# EAGLE design cj-mini (EAGLE 7.7.0)
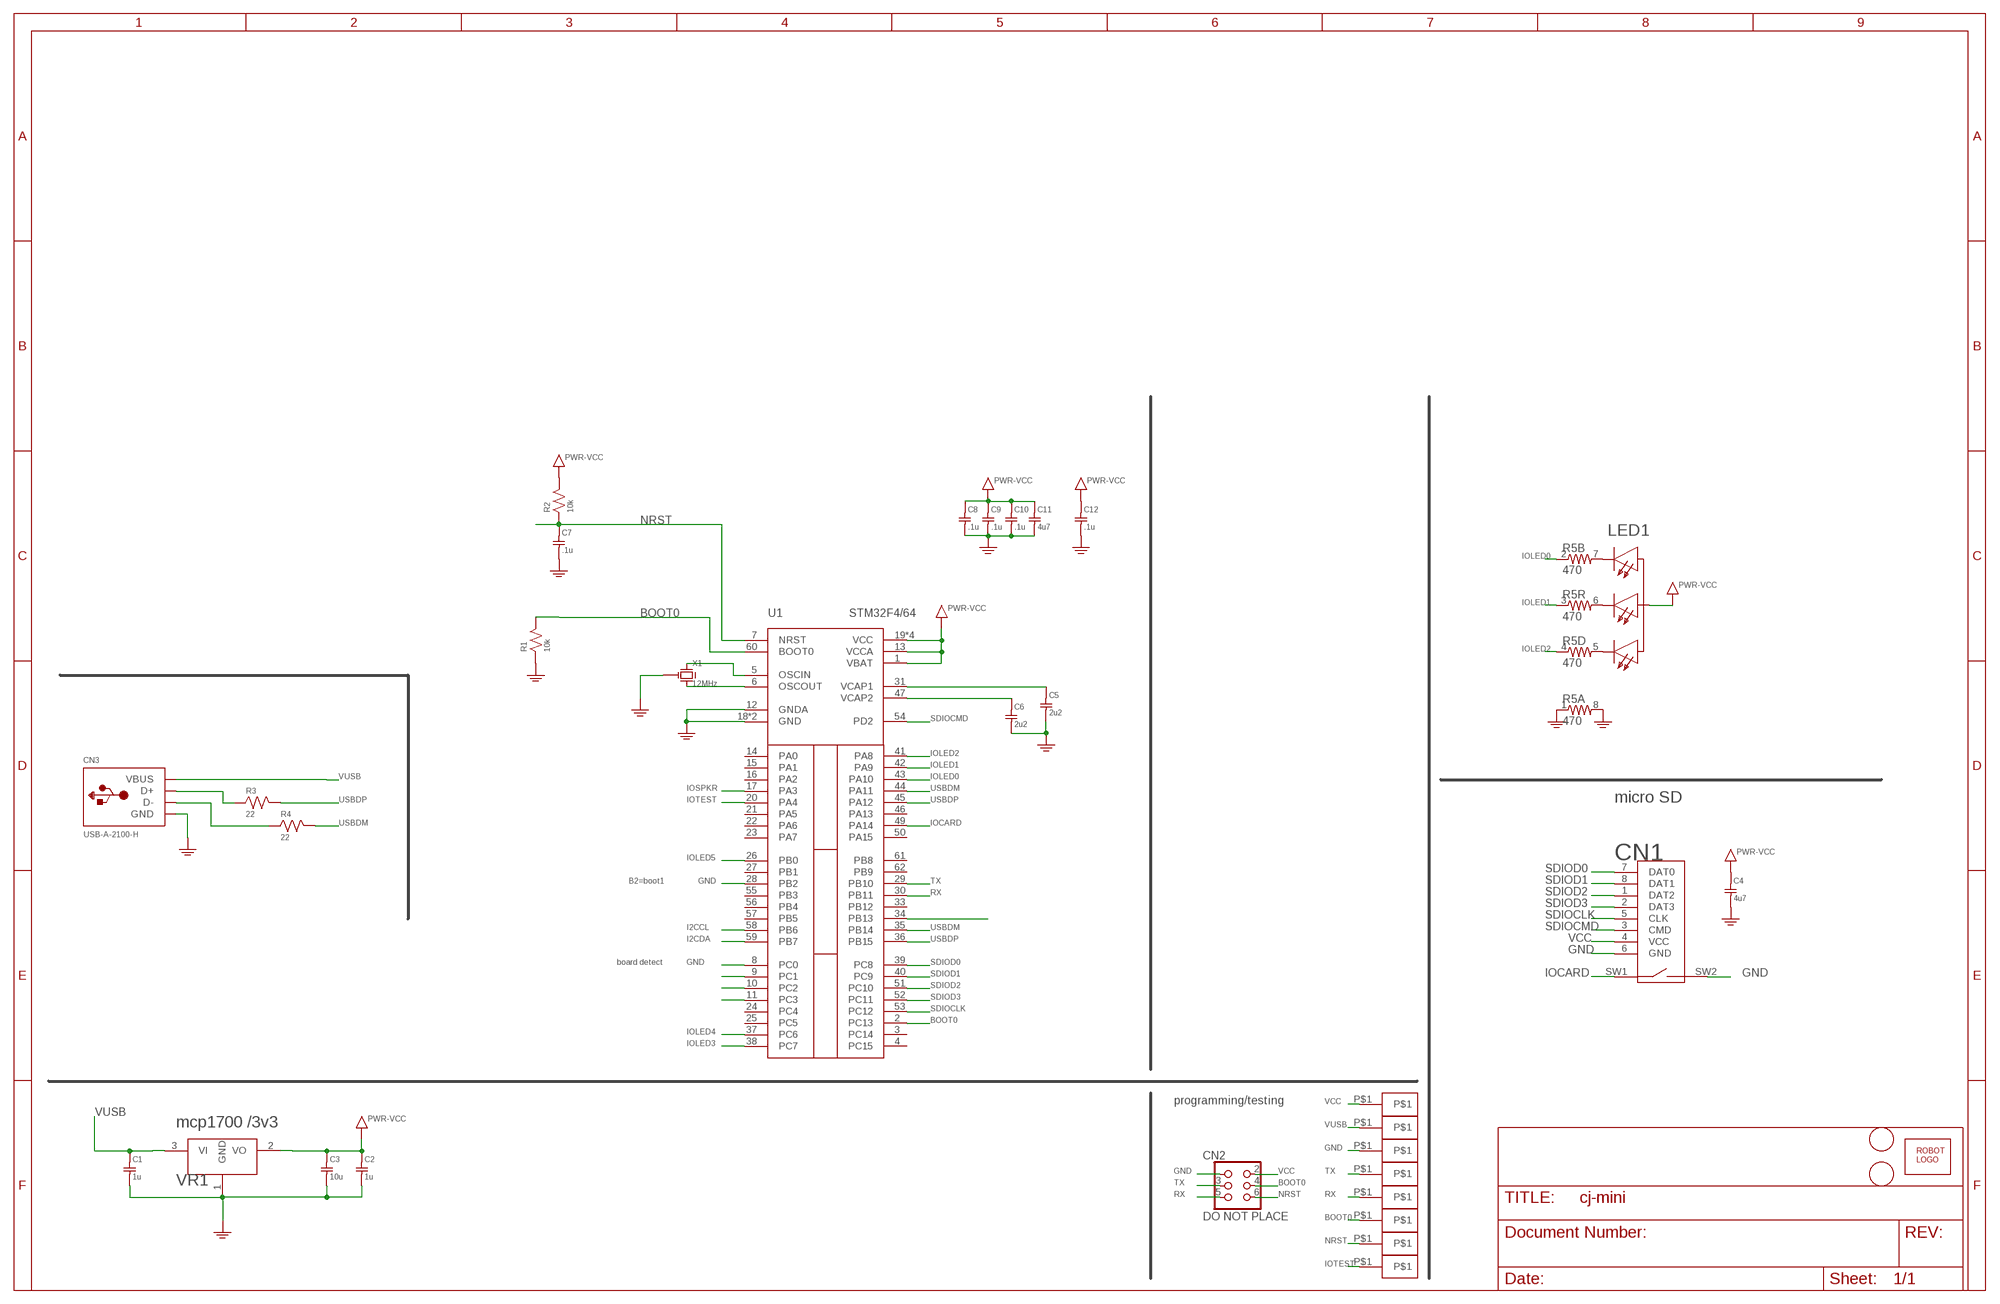
[diagram p0: schematic, sheet 1]

## Parts
C1  1u  C0603  [SMD0603]
C2  1u  C0603  [SMD0603]
C3  10u  C0603  [SMD0603]
C4  4u7  C0603  [SMD0603]
C5  2u2  C0603  [SMD0603]
C6  2u2  C0603  [SMD0603]
C7  .1u  C0603  [SMD0603]
C8  .1u  C0603  [SMD0603]
C9  .1u  C0603  [SMD0603]
C10  .1u  C0603  [SMD0603]
C11  4u7  C0603  [SMD0603]
C12  .1u  C0603  [SMD0603]
CN1  MICROSDPLAIN  [MICROSD/MOLEX/FRONT/PLAIN]
CN2  DO NOT PLACE  HEADER-3X2-PTH1.27  [HEADER-3X2-PTH1.27]
CN3  USB-A-2100-H  [MOLEX_480372100-HOLE]
CN4  HEADER-1X1-SPOT  [SPOT]
CN5  HEADER-1X1-SPOT  [SPOT]
CN6  HEADER-1X1-SPOT  [SPOT]
CN7  HEADER-1X1-SPOT  [SPOT]
CN8  HEADER-1X1-SPOT  [SPOT]
CN9  HEADER-1X1-SPOT  [SPOT]
CN10  HEADER-1X1-SPOT  [SPOT]
CN11  HEADER-1X1-SPOT  [SPOT]
LED1  LED-RGB-CA-PLCC4  [PLCC4-3228]
R1  10k  R0603  [SMD0603]
R2  10k  R0603  [SMD0603]
R3  22  R0603  [SMD0603]
R4  22  R0603  [SMD0603]
R5  470  R-ARRAY40603-ARV  [SMD-0603-ARV]
U1  STM32F4/64  [TQFP64]
U$1  ROBOTMAN-LOGO  [ROBOTMAN-LOGO]
U$2  FIDUCIAL  [FIDUCIAL_1MM]
U$3  FIDUCIAL  [FIDUCIAL_1MM]
VR1  mcp1700 /3v3  REGULATOR-SOT23-3  [SOT-23-3@1]
X1  12MHz  RESONATORCTCE  [RESONATOR-CSTCE]

## Nets
BOOT0: CN2.4 CN8.P$1 R1.2 U1.2(PC13) U1.60(BOOT0)
GND: C1.2 C2.2 C3.2 C4.2 C5.2 C6.2 C7.2 C8.2 C9.2 C10.2 C11.2 C12.2 CN1.6(GND) CN1.SW2 CN2.1 CN3.4(GND) CN3.P$1(GND) CN3.P$2(GND) CN5.P$1 R1.1 R5.1 R5.8 U1.8(PC0) U1.12(GNDA) U1.18(GND) U1.28(PB2) U1.63(GND) VR1.1(GND) X1.2(G) ; supply symbol labelled PWR-GND
I2CCL: U1.58(PB6)
I2CDA: U1.59(PB7)
IOCARD: CN1.SW1 U1.49(PA14)
IOLED0: R5.2 U1.43(PA10)
IOLED1: R5.3 U1.42(PA9)
IOLED2: R5.4 U1.41(PA8)
IOLED3: U1.38(PC7)
IOLED4: U1.37(PC6)
IOLED5: U1.26(PB0)
IOSPKR: U1.17(PA3)
IOTEST: CN11.P$1 U1.20(PA4)
N$1: LED1.P$4(CB) R5.6
N$2: U1.34(PB13)
N$3: LED1.P$2(CR) R5.5
N$4: C6.1 U1.47(VCAP2)
N$5: LED1.P$3(CG) R5.7
N$6: U1.9(PC1)
N$7: CN3.2(D-) R4.1
N$8: CN3.3(D+) R3.1
N$9: U1.10(PC2)
N$10: U1.11(PC3)
N$12: U1.5(OSCIN) X1.1(X1)
N$13: U1.6(OSCOUT) X1.3(X2)
N$18: C5.1 U1.31(VCAP1)
NRST: C7.1 CN2.6 CN9.P$1 R2.1 U1.7(NRST)
RX: CN2.5 CN7.P$1 U1.30(PB11)
SDIOCLK: CN1.5(CLK) U1.53(PC12)
SDIOCMD: CN1.3(CMD) U1.54(PD2)
SDIOD0: CN1.7(DAT0) U1.39(PC8)
SDIOD1: CN1.8(DAT1) U1.40(PC9)
SDIOD2: CN1.1(DAT2) U1.51(PC10)
SDIOD3: CN1.2(DAT3) U1.52(PC11)
TX: CN2.3 CN6.P$1 U1.29(PB10)
USBDM: R4.2 U1.35(PB14) U1.44(PA11)
USBDP: R3.2 U1.36(PB15) U1.45(PA12)
VCC: C2.1 C3.1 C4.1 C8.1 C9.1 C10.1 C11.1 C12.1 CN1.4(VCC) CN2.2 CN10.P$1 LED1.P$1(A) R2.2 U1.1(VBAT) U1.13(VCCA) U1.19(VCC) U1.32(VCC) U1.48(VCC) U1.64(VCC) VR1.2(VO) ; supply symbol labelled PWR-VCC
VUSB: C1.1 CN3.1(VBUS) CN4.P$1 VR1.3(VI)
Unconnected: U1.3(PC14) U1.4(PC15) U1.14(PA0) U1.15(PA1) U1.16(PA2) U1.21(PA5) U1.22(PA6) U1.23(PA7) U1.24(PC4) U1.25(PC5) U1.27(PB1) U1.33(PB12) U1.46(PA13) U1.50(PA15) U1.55(PB3) U1.56(PB4) U1.57(PB5) U1.61(PB8) U1.62(PB9)

## Notes on the sheet
- micro SD
- B2=boot1
- board detect
- programming/testing

## Library data of the parts
C1-C12 = jaw:C
CN1 = jaw:MICROSD
CN2 = jaw-conn:HEADER-3X2
CN3 = jaw-conn:USB-A: USB type A 'plug' Used for things that can directly connect to a USB port, say USB key
CN4-CN11 = jaw-conn:HEADER-1X1
LED1 = jaw:LED-RGB-CA
R1-R4 = jaw:R
R5 = jaw:R-ARRAY4: Array Chip Resistor Source: RS Component / Phycomp
U1 = jaw-ic:STM32F4/64
U$1 = jaw:ROBOTMAN-LOGO
U$2 U$3 = adafruit:FIDUCIAL: For use by pick and place machines to calibrate the vision/machine, 1mm By microbuilder.eu
VR1 = jaw:REGULATOR
X1 = jaw:RESONATOR

## Board
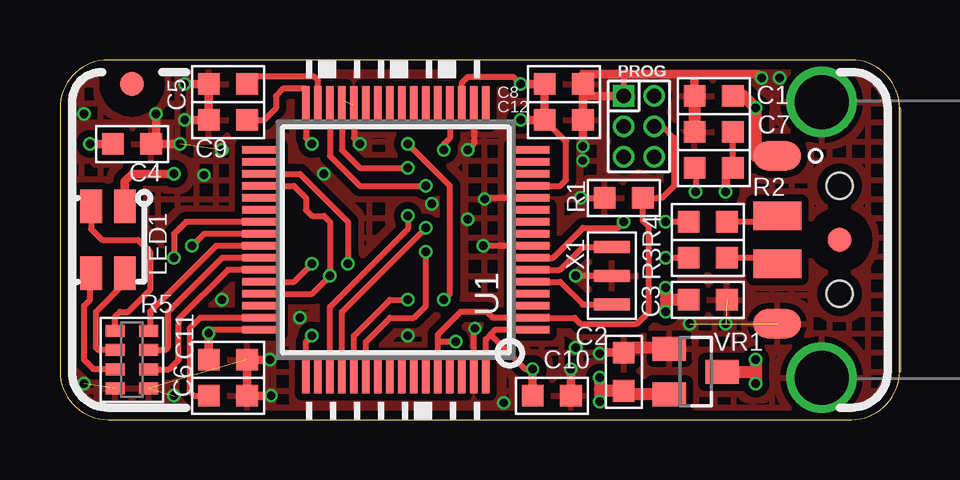
[diagram p1: board, top side]
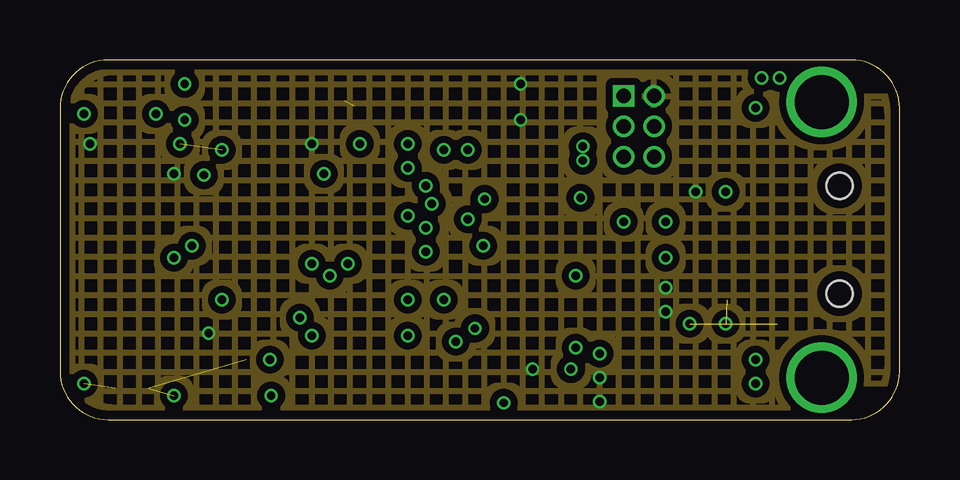
[diagram p2: board, inner layer Route2]
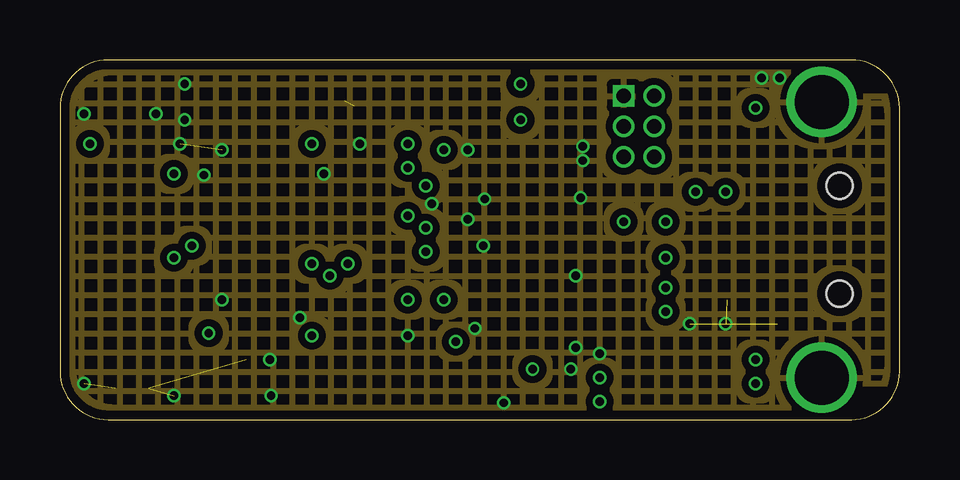
[diagram p3: board, inner layer Route15]
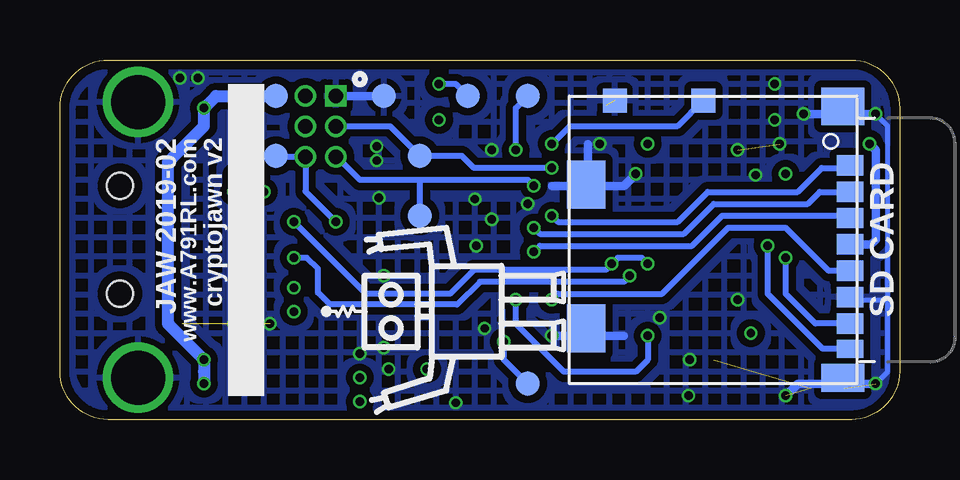
[diagram p4: board, bottom side, seen from below]

Size 35 x 15 mm. Coordinates in mm from the lower left corner, seen from the top.
Outline: 0,13 0,2 arc90 2,0 33,0 arc90 35,2 35,5 35,5.5 35,9.5 35,10 35,12.25 35,13 arc90 33,15 2,15 arc90 0,13
Copper layers (1*2*15*16): Top 0.035559375mm / dielectric 0.17018125mm / Route2 0.01778125mm / dielectric 47mil / Route15 0.01778125mm / dielectric 0.17018125mm / Bottom 0.035559375mm
Design rules "OSHPark-4layer *": minimum track width 5mil, minimum drill 10mil, track to track 7mil, track to pad 7mil, pad to pad 7mil, via to via 7mil, smd to smd 5mil, copper to edge 15mil, drill to drill 6mil, minimum pad ring 4mil, minimum via ring 4mil, stop-mask expansion 4mil, vias tented up to drill 0.5mm, thermal gap 10mil

### Footprints (pad centres in the part's own frame; a part is rotated, then mirrored left to right if it is on the bottom)
SMD0603 = smd 0.9 x 0.9: 1 -0.8,0; 2 0.8,0
MICROSD/MOLEX/FRONT/PLAIN = smd 0.85 x 1.1: 1 3.105,-4.43; 2 2.005,-4.43; 3 0.905,-4.43; 4 -0.195,-4.43; 5 -1.295,-4.43; 6 -2.395,-4.43; 7 -3.495,-4.43 | smd 0.75 x 1.1: 8 -4.545,-4.43 | smd 1.17 x 1.8: P$1 -5.755,-4.13 | smd 1.55 x 1.8: P$2 5.565,-4.13 | smd 2 x 1.6: P$3 -3.7,6.57; P$4 2.3,6.57 | smd 1 x 1: SW1 5.8,1.67; SW2 5.8,5.37
HEADER-3X2-PTH1.27 = drill 0.6 pad 0.9 square: 1 0,0 | drill 0.6 pad 0.9: 2 0,1.27; 3 1.27,0; 4 1.27,1.27; 5 2.54,0; 6 2.54,1.27
MOLEX_480372100-HOLE = smd 1.2 x 2: 1 -3.5,-9.6; 2 -1,-9.6; 3 1,-9.6; 4 3.5,-9.6 | drill 2.25 pad 2.75: P$1 -5.75,-7.75; P$2 5.75,-7.75 | hole 1.1: -2.25,-7; 2.25,-7
SPOT = smd 1 x 1: P$1 0,0
PLCC4-3228 = smd 1.4 x 0.9: P$1 -1.4,0.7; P$2 -1.4,-0.7; P$3 1.4,-0.7; P$4 1.4,0.7
SMD-0603-ARV = smd 0.5 x 0.8: 1 -1.2,-0.7; 2 -0.4,-0.7; 3 0.4,-0.7; 4 1.2,-0.7; 5 1.2,0.7; 6 0.4,0.7; 7 -0.4,0.7; 8 -1.2,0.7
TQFP64 = smd 1.6 x 0.3: 1 -5.6,3.75; 2 -5.6,3.25; 3 -5.6,2.75; 4 -5.6,2.25; 5 -5.6,1.75; 6 -5.6,1.25; 7 -5.6,0.75; 8 -5.6,0.25; 9 -5.6,-0.25; 10 -5.6,-0.75; 11 -5.6,-1.25; 12 -5.6,-1.75; 13 -5.6,-2.25; 14 -5.6,-2.75; 15 -5.6,-3.25; 16 -5.6,-3.75; 33 5.6,-3.75; 34 5.6,-3.25; 35 5.6,-2.75; 36 5.6,-2.25; 37 5.6,-1.75; 38 5.6,-1.25; 39 5.6,-0.75; 40 5.6,-0.25; 41 5.6,0.25; 42 5.6,0.75; 43 5.6,1.25; 44 5.6,1.75; 45 5.6,2.25; 46 5.6,2.75; 47 5.6,3.25; 48 5.6,3.75 | smd 0.3 x 1.6: 17 -3.75,-5.6; 18 -3.25,-5.6; 19 -2.75,-5.6; 20 -2.25,-5.6; 21 -1.75,-5.6; 22 -1.25,-5.6; 23 -0.75,-5.6; 24 -0.25,-5.6; 25 0.25,-5.6; 26 0.75,-5.6; 27 1.25,-5.6; 28 1.75,-5.6; 29 2.25,-5.6; 30 2.75,-5.6; 31 3.25,-5.6; 32 3.75,-5.6; 49 3.75,5.6; 50 3.25,5.6; 51 2.75,5.6; 52 2.25,5.6; 53 1.75,5.6; 54 1.25,5.6; 55 0.75,5.6; 56 0.25,5.6; 57 -0.25,5.6; 58 -0.75,5.6; 59 -1.25,5.6; 60 -1.75,5.6; 61 -2.25,5.6; 62 -2.75,5.6; 63 -3.25,5.6; 64 -3.75,5.6
FIDUCIAL_1MM = smd 1 x 1: 1 0,0
SOT-23-3@1 = smd 1 x 1.4: 1 -0.95,-1.1; 2 0.95,-1.1; 3 0,1.1
RESONATOR-CSTCE = smd 0.5 x 1.5: 1 -1.2,0; 2 0,0; 3 1.2,0

### Placement (x,y rotation side)
C1  27.25,13.5 180 top
C2  23.5,2 90 top
C3  27,5 0 top
C4  3,11.5 0 top
C5  7,14 180 top
C6  7,1 0 top
C7  27.25,12 180 top
C8  21,14 0 top
C9  7,12.5 180 top
C10  20.5,1 0 top
C11  7,2.5 0 top
C12  21,12.5 0 top
CN1  6.5,7.5 90 bottom
CN2  23.5,13.5 270 top
CN3  39.5,7.5 270 top
CN4  26,13.5 0 bottom
CN5  21.5,13.5 0 bottom
CN6  20,11 0 bottom
CN7  20,8.5 0 bottom
CN8  15.5,1.5 0 bottom
CN9  26,11 0 bottom
CN10  18,13.5 0 bottom
CN11  15.5,13.5 0 bottom
LED1  2,7.5 270 top
R1  23.5,9.25 0 top
R2  27.25,10.5 180 top
R3  27,6.75 180 top
R4  27,8.25 180 top
R5  3,2.5 90 top
U1  14,7.5 180 top
U$1  18.3,4.51 90 bottom
U$2  3,14 0 top
U$3  32.5,7.5 0 top
VR1  26.5,2 270 top
X1  23,6 90 top

### Tracks (layer width: path | path; a pad name or v marks a point on that pad's centre or on a via)
BOOT0  (via drill 0.35)
  Top 0.25: U1.60 15.75,3.25 | 15.75,3.25 15.75,3.55 16.7,4.5 17.8,4.5 18.05,4.25 U1.2 21.45,4.25 21.7,4 24.05,4 24.55,4.5 24.55,8.05 24.3,8.3 R1.2 24.9,9.25 25.1,9.25 25.6,9.75 25.6,11.75 25.12,12.23 24.87,12.23 CN2.4 | v16.5,3.25 15.75,3.25
  Bottom 0.25: CN8.P$1 16.5,2.5 v16.5,3.25
GND  (via drill 0.35)  (7 unrouted)
  Top 0.25: X1.2 v21.5,6 | 7.8,2.4 C11.2 | U1.63 17.25,3.75 v17.3,3.8 | U1.28 12.25,11.75 v12.5,11.5 | U1.12 17.75,9.25 v17.7,9.2 | v21.7,9.25 R1.1 | CN2.1 23.5,14.25 | U1.8 v17.65,7.25 | U1.18 17.25,11.5 v17,11.25
  Top 0.35: 7.8,2.4 7.8,2.55 C6.2 v8.8,1 | v5.2,14 C5.2 C9.2 v5.2,12.5 | C10.2 v21.3,2.1 | 21.8,13.5 C12.2 v21.8,11.4 | 21.8,13.5 21.8,13.9 | 21.8,13.9 C8.2 21.8,14.4 23.2,14.4 26.5,14.4 | 21.8,13.9 21.8,13.5 | 21.8,13.5 23.45,13.5 | C2.2 22.55,2.8 v22.5,2.75 | 26.5,14.4 28.95,14.4 29.1,14.4 v29.25,14.25 | C1.2 26.45,14.4 26.5,14.4 | v4,12.75 4,11.7 C4.2 v5,11.5 | v8.75,2.5 7.75,2.5
  Top 0.5: VR1.1 25.45,2.95 25.5,3 23.7,3 C2.2 | C1.2 C7.2
  Bottom 0.2: 0.5,5 0.5,2 v1,1.5 | 0.5,5 0.5,12.25 v1,12.75 | 2.07,5 0.5,5
  Bottom 0.25: CN1.6 2.07,5
  Bottom 0.35: CN5.P$1 CN2.1 | v1,12.75 v4,12.75 | v1,1.5 4.25,1.5 v4.75,1 | 13,9.75 14.5,9.75 13,9.75 | 13,9.75 11.5,9.75 v11,10.25 | v14.5,3.5 11.5,3.5 | 13,9.75 13,11.5
  other vias: 27.75,4 21.8,10.8 21.5,3 6,10.2 15.5,9 18.5,0.7 17,8.35 6.75,11.25 30,14.25 26.25,4 10,4.25 6.75,5
  pour Route15 (isolate 0.3, hatched): -7.2,15 32.6,15 32.6,13.5 38.7,13.5 38.7,1.5 32.6,1.5 32.6,0 -7.2,0
  pour Bottom (isolate 0.3, hatched): -0.2,15 35.45,15 35.45,0 -0.2,0
  pour Top (isolate 0.3, rank 5, hatched): -0.2,15 35.45,15 35.45,0 -0.2,0
IOCARD  (via drill 0.35)
  Top 0.25: U1.49 10.25,3.25 v10.5,3.5 | v16,5 16.25,5.25 16.25,7 16.25,9.75 v14.5,11.5
  Bottom 0.25: v10.5,3.5 10.5,2.5 11,2 14,2 16,4 v16,5 | v14.5,11.5 13.75,12.25 9.25,12.25 8.2,13.3 CN1.SW1
IOLED0
  Top 0.25: U1.43 7,6.25 4.95,4.2 4.95,4 4.95,2.5 4.55,2.1 R5.2
IOLED1
  Top 0.25: U1.42 6.75,6.75 4.5,4.5 4.5,4.25 4.5,3 4.4,2.9 R5.3
IOLED2
  Top 0.25: U1.41 6.5,7.25 3.75,4.5 3.75,3.75 R5.4
IOTEST  (via drill 0.35)
  Top 0.25: U1.20 16.25,11.75 16,11.5 v16,11.25
  Bottom 0.25: v16,11.25 16,13 CN11.P$1
N$1
  Top 0.25: R5.6 1.6,2.9 1.5,3 1.5,4.25 1.5,4.5 2.7,5.7 LED1.P$4 2.75,6.05
N$3
  Top 0.25: LED1.P$2 1.3,7.95 1.75,7.5 3.25,7.5 3.75,7 3.75,5.4 2.85,4.5 2.5,4.5 2.3,4.3 R5.5
N$4
  Top 0.25: U1.47 5.85,4.25 5.4,3.8 5.4,1.2 5.6,1 C6.1
N$5
  Top 0.25: R5.7 1.4,2.1 1,2.5 1,4.75 1.25,5 1.25,6.05 LED1.P$3
N$7
  Top 0.25: CN3.2 30.15,8.25 R4.1
N$8
  Top 0.25: CN3.3 30.15,6.75 R3.1
N$12
  Top 0.25: U1.5 20.85,5.75 21.8,4.8 X1.1
N$13
  Top 0.25: U1.6 20.85,6.25 21.8,7.2 X1.3
N$18
  Top 0.25: U1.31 10.75,14.15 10.6,14.3 8.1,14.3 C5.1
NRST  (via drill 0.35)
  Top 0.25: U1.7 20.55,6.75 21.8,8 23.25,8 v23.5,8.25 | R2.1 C7.1
  Top 0.35: v27.75,9.5 27.75,10.2 R2.1
  Bottom 0.25: v23.5,8.25 24.77,9.52 CN2.6 25.96,10.96 CN9.P$1 27.05,11 27.8,10.25 27.8,9.55 v27.75,9.5
RX  (via drill 0.35)
  Top 0.25: U1.30 11.25,11 12.5,9.75 v15.25,9.75
  Bottom 0.25: v15.25,9.75 15.5,10 20,10 | 20,10 22.5,10 23.46,10.96 CN2.5 | CN7.P$1 20,10
SDIOCLK  (via drill 0.35)
  Top 0.25: U1.53 12.25,3.5 13.75,5 v14.5,5
  Bottom 0.25: v14.5,5 14.25,5.25 9.9,5.25 7.15,8 4.75,8 2.95,6.2 CN1.5
SDIOCMD  (via drill 0.35)
  Top 0.25: U1.54 12.75,3.25 13.75,4.25 14.75,4.25 15.25,4.75 v15.25,7
  Bottom 0.25: v15.25,7 15,7.25 8.65,7.25 7.4,8.5 4.5,8.5 3.5,8.5 2.16,8.5 CN1.3
SDIOD0  (via drill 0.35)
  Top 0.25: U1.39 5.75,8.25 5.25,8.25 4.75,7.75 v4.75,6.75
  Bottom 0.25: CN1.7 3.5,4.01 4.75,5.25 v4.75,6.75
SDIOD1  (via drill 0.35)
  Top 0.25: U1.40 6.05,7.75 6,7.75 v5.5,7.25
  Bottom 0.25: CN1.8 3.2,2.96 5.5,5.25 v5.5,7.25
SDIOD2  (via drill 0.35)
  Top 0.25: U1.51 11.25,4.7 14.5,7.95 v14.5,8.5
  Bottom 0.25: v14.5,8.5 14.25,8.25 9.25,8.25 8,9.5 4.25,9.5 3.25,10.5 2.18,10.5 CN1.1
SDIOD3  (via drill 0.35)
  Top 0.25: U1.52 11.75,4.5 v15.25,8
  Bottom 0.25: v15.25,8 15,7.75 9,7.75 7.75,9 3.82,9 3.32,9.5 2.25,9.5 CN1.2
TX  (via drill 0.35)
  Top 0.25: U1.29 11.75,11.25 12.5,10.5 v14.5,10.5
  Bottom 0.25: CN2.3 21.43,12.23 21.23,12.23 CN6.P$1 18.25,11 17.75,10.5 14.75,10.5 v14.5,10.5
USBDM  (via drill 0.35)
  Top 0.25: R4.2 v25.25,8.25 | U1.44 9.75,5.75 v10.5,6.5 | U1.35 10,10.25 12,8.25 v12,6.5
  Bottom 0.25: v10.5,6.5 10.75,6.75 11.75,6.75 v12,6.5 12.25,6.25 17.75,6.25 18.75,5.25 22.25,5.25 v25.25,8.25
USBDP  (via drill 0.35)
  Top 0.25: R3.2 v25.25,6.75 | U1.45 10.5,5.25 v11.25,6 11.25,8.25 11,8.5 10.5,8.5 10.25,8.75 10.25,9.25 9.75,9.75 U1.36
  Bottom 0.25: v25.25,6.75 24.7,6.75 24.25,6.3 24.25,5.3 23.75,4.8 18.45,4.8 17.5,5.75 11.5,5.75 v11.25,6
VCC  (via drill 0.35)
  Top 0.25: U1.48 6.65,3.75 6.35,3.75 v6.2,3.6 | U1.64 17.75,3.35 17.95,3.55 | 17.95,3.55 18.1,3.7 18.15,3.75 U1.1 | v19.7,2.1 19.4,2.1 17.95,3.55 | U1.13 20.85,9.75 21.1,10 21.1,11.6 C12.1 | U1.19 16.75,14.05 17,14.3 18.9,14.3 v19.2,14 | C9.1 8.5,12.5 9,13 9,13.5 9.3,13.8 10.25,13.8 U1.32 10.25,11.75 v10.5,11.5 | R2.2 26.5,10.5 v26.5,9.5
  Top 0.35: C11.1 6.2,3.3 v6.2,3.6 | C10.1 v19.7,2.1 | v19.2,14 C8.1 C12.1 v19.2,12.5 | C4.1 v1.25,11.5 | LED1.P$1 2.7,9.95 3,10.25 v4.75,10.25
  Top 0.5: VR1.2 23.65,1.05 C2.1 22.55,1.2 22.5,1.25 | v22.5,1.75 22.5,1.25 | 22.5,1.25 v22.5,0.75 | v25.25,5.5 25.25,5 | 25.25,5 v25.25,4.5 | C3.1 25.25,5
  Bottom 0.25: CN10.P$1 18.5,14 v19.2,14
  Bottom 0.35: CN1.4 1.2,7.3 1,7.5 1,11.25 v1.25,11.5
  pour Route2 (isolate 0.3, hatched): -7.2,15 32.6,15 32.6,13.5 38.7,13.5 38.7,1.5 32.6,1.5 32.6,0 -7.2,0
VUSB  (via drill 0.35)
  Top 0.5: CN3.1 29,11 v29,13 28.5,13.5 C1.1 | VR1.3 29,2 | 29,2 v29,1.5 | v29,2.5 29,2
  Bottom 0.5: v29,1.5 29,2 v29,2.5 30.5,4 30.5,4.1 30.5,10.75 29,12.25 v29,13 28.5,13.5 CN4.P$1

### Text on the board
tPlace: PROG
bPlace: cryptojawn v2 | www.A791RL.com | JAW 2019-02 | SD CARD